# Altium schematic sheet Top_Sheet.SchDoc: Top Sheet
size A4; ApprovedBy: Watzek; CheckedBy: Watzek; Author: Watzek; DrawnBy: Watzek; Organization: HTL Hollabrunn; Address1: Abteilung Elektronik; Address2: Anton Ehrenfried-Straße 10; Address3: 2020 Hollabrunn; DocumentNumber: 01; Revision: 02; SheetNumber: 01; SheetTotal: 12; SPICEModelCacheIHPBHSPQ: <root> / <DocumentId>IHPBHSPQ</DocumentId> / <CacheFrame Number="0"> / <Model Name="cap" Kind="MDL"> / <Text>*Default semiconductor capacitor / .MODEL CAP C()</Text> / </Model> / </CacheFrame> / </root>
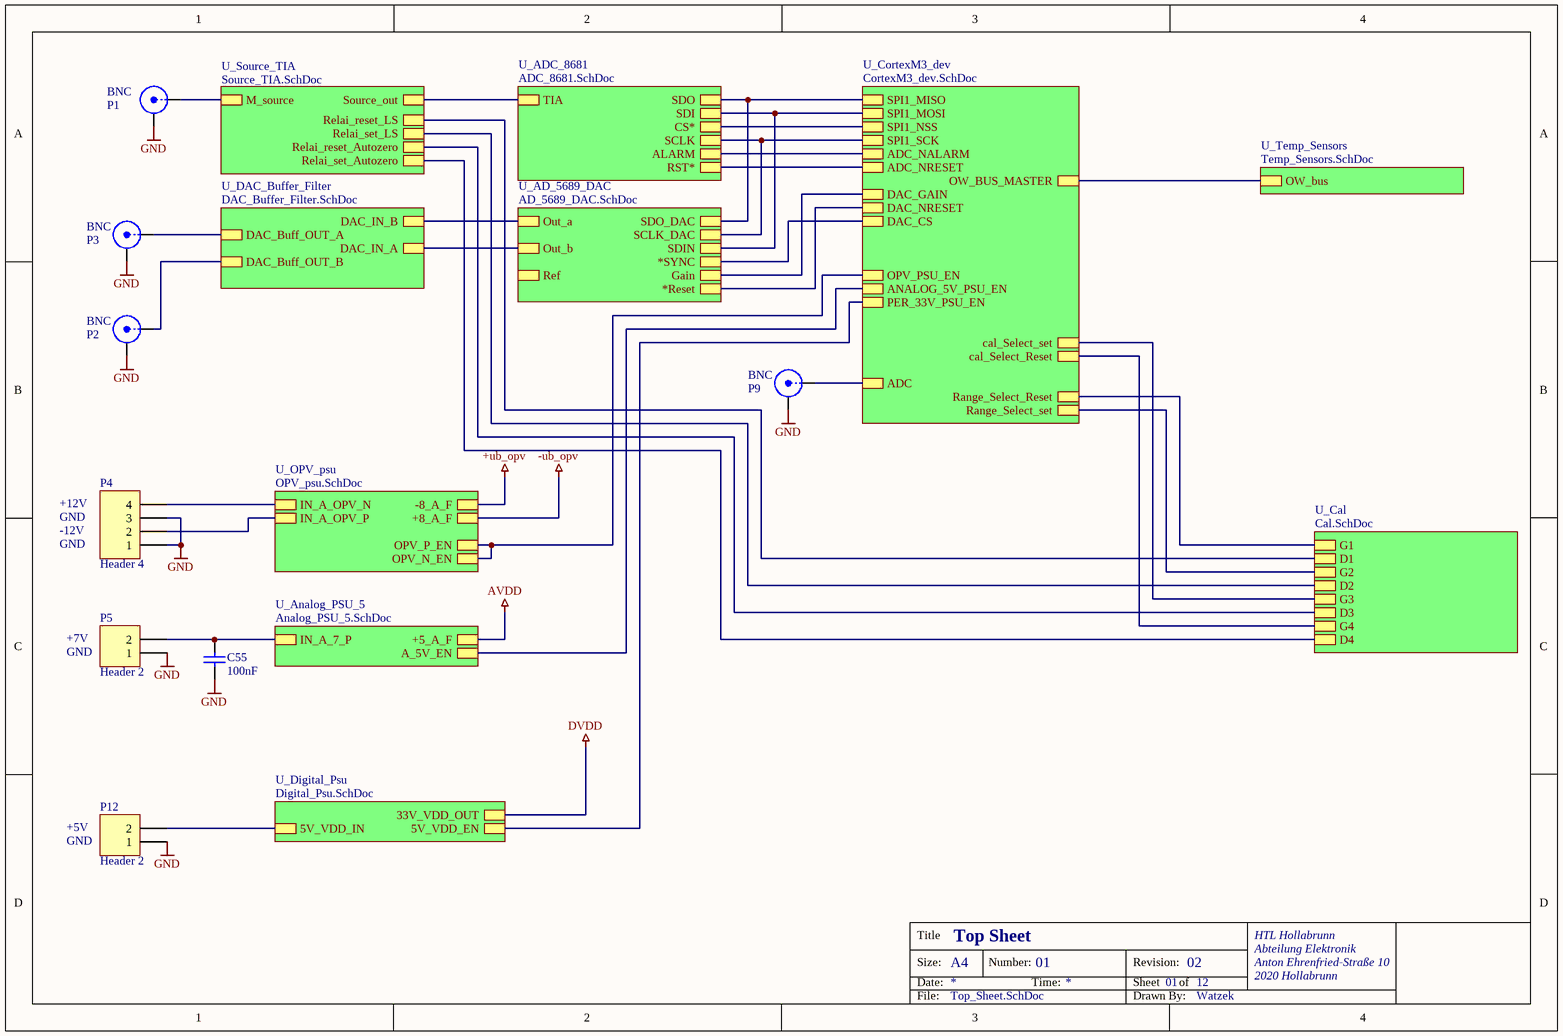
[diagram p0: Top_Sheet.SchDoc]

## Parts
C55  100nF  [C1206-KUE]
P1  BNC  [BNC_RA CON]
P2  BNC  [BNC_RA CON]
P3  BNC  [BNC_RA CON]
P4  Header 4  [HDR1X4]
P5  Header 2  [HDR1X2]
P9  BNC  [BNC_RA CON]
P12  Header 2  [HDR1X2]

## Sub-sheets
U_AD_5689_DAC = AD_5689_DAC.SchDoc: Ref, Out_a, Out_b, SDIN, SDO_DAC, SCLK_DAC, *SYNC, Gain, *Reset
U_ADC_8681 = ADC_8681.SchDoc: SDI, CS*, SCLK, SDO, ALARM, RST*, TIA
U_Analog_PSU_5 = Analog_PSU_5.SchDoc: IN_A_7_P, +5_A_F, A_5V_EN
U_Cal = Cal.SchDoc: G1, G2, D1, D2, G3, D3, G4, D4
U_CortexM3_dev = CortexM3_dev.SchDoc: SPI1_NSS, SPI1_SCK, SPI1_MISO, SPI1_MOSI, ADC_NALARM, ADC_NRESET, DAC_GAIN, DAC_NRESET, DAC_CS, OW_BUS_MASTER, OPV_PSU_EN, ANALOG_5V_PSU_EN, PER_33V_PSU_EN, Range_Select_set, Range_Select_Reset, ADC, cal_Select_Reset, cal_Select_set
U_DAC_Buffer_Filter = DAC_Buffer_Filter.SchDoc: DAC_IN_B, DAC_Buff_OUT_B, DAC_IN_A, DAC_Buff_OUT_A
U_Digital_Psu = Digital_Psu.SchDoc: 5V_VDD_IN, 33V_VDD_OUT, 5V_VDD_EN
U_OPV_psu = OPV_psu.SchDoc: IN_A_OPV_P, +8_A_F, IN_A_OPV_N, -8_A_F, OPV_P_EN, OPV_N_EN
U_Source_TIA = Source_TIA.SchDoc: M_source, Source_out, Relai_set_LS, Relai_reset_LS, Relai_reset_Autozero, Relai_set_Autozero
U_Temp_Sensors = Temp_Sensors.SchDoc: OW_bus

## Nets
+ub_opv: sheet U_OPV_psu/-8_A_F
-ub_opv: sheet U_OPV_psu/+8_A_F
AVDD: sheet U_Analog_PSU_5/+5_A_F
DVDD: sheet U_Digital_Psu/33V_VDD_OUT
GND: C55.1 P1.2(Y) P2.2(Y) P3.2(Y) P4.1 P4.3 P5.1 P9.2(Y) P12.1
NetC55_2: C55.2 P5.2 ; sheet U_Analog_PSU_5/IN_A_7_P
NetP1_1: P1.1(X) ; sheet U_Source_TIA/M_source
NetP2_1: P2.1(X) ; sheet U_DAC_Buffer_Filter/DAC_Buff_OUT_B
NetP3_1: P3.1(X) ; sheet U_DAC_Buffer_Filter/DAC_Buff_OUT_A
NetP4_2: P4.2 ; sheet U_OPV_psu/IN_A_OPV_P
NetP4_4: P4.4 ; sheet U_OPV_psu/IN_A_OPV_N
NetP9_1: P9.1(X) ; sheet U_CortexM3_dev/ADC
NetP12_2: P12.2 ; sheet U_Digital_Psu/5V_VDD_IN
(unnamed): sheet U_Source_TIA/Source_out, sheet U_ADC_8681/TIA
(unnamed): sheet U_Source_TIA/Relai_set_LS, sheet U_Cal/D2
(unnamed): sheet U_Source_TIA/Relai_reset_LS, sheet U_Cal/D1
(unnamed): sheet U_Source_TIA/Relai_reset_Autozero, sheet U_Cal/D3
(unnamed): sheet U_Source_TIA/Relai_set_Autozero, sheet U_Cal/D4
(unnamed): sheet U_DAC_Buffer_Filter/DAC_IN_B, sheet U_AD_5689_DAC/Out_a
(unnamed): sheet U_DAC_Buffer_Filter/DAC_IN_A, sheet U_AD_5689_DAC/Out_b
(unnamed): sheet U_ADC_8681/SDI, sheet U_AD_5689_DAC/SDIN, sheet U_CortexM3_dev/SPI1_MOSI
(unnamed): sheet U_ADC_8681/CS*, sheet U_CortexM3_dev/SPI1_NSS
(unnamed): sheet U_ADC_8681/SCLK, sheet U_AD_5689_DAC/SCLK_DAC, sheet U_CortexM3_dev/SPI1_SCK
(unnamed): sheet U_ADC_8681/SDO, sheet U_AD_5689_DAC/SDO_DAC, sheet U_CortexM3_dev/SPI1_MISO
(unnamed): sheet U_ADC_8681/ALARM, sheet U_CortexM3_dev/ADC_NALARM
(unnamed): sheet U_ADC_8681/RST*, sheet U_CortexM3_dev/ADC_NRESET
(unnamed): sheet U_AD_5689_DAC/*SYNC, sheet U_CortexM3_dev/DAC_CS
(unnamed): sheet U_AD_5689_DAC/Gain, sheet U_CortexM3_dev/DAC_GAIN
(unnamed): sheet U_AD_5689_DAC/*Reset, sheet U_CortexM3_dev/DAC_NRESET
(unnamed): sheet U_Temp_Sensors/OW_bus, sheet U_CortexM3_dev/OW_BUS_MASTER
(unnamed): sheet U_Digital_Psu/5V_VDD_EN, sheet U_CortexM3_dev/PER_33V_PSU_EN
(unnamed): sheet U_Analog_PSU_5/A_5V_EN, sheet U_CortexM3_dev/ANALOG_5V_PSU_EN
(unnamed): sheet U_OPV_psu/OPV_P_EN, sheet U_OPV_psu/OPV_N_EN, sheet U_CortexM3_dev/OPV_PSU_EN
(unnamed): sheet U_CortexM3_dev/Range_Select_set, sheet U_Cal/G2
(unnamed): sheet U_CortexM3_dev/Range_Select_Reset, sheet U_Cal/G1
(unnamed): sheet U_CortexM3_dev/cal_Select_Reset, sheet U_Cal/G4
(unnamed): sheet U_CortexM3_dev/cal_Select_set, sheet U_Cal/G3

## Notes on the sheet
- +12V
- GND
- -12V
- +7V
- +5V
- Title
- Size:
- Date:
- A4
- Number:
- Time:
- Revision:
- Sheet
- of
- HTL Hollabrunn
- Abteilung Elektronik
- Anton Ehrenfried-Straße 10
- 2020 Hollabrunn
- File:
- Drawn By:

## Library data of the parts
C55 = Capacitor: Manufacturer: Kemet; Bezeichnung: Kerko +-10% 63V; Published: 8-Jun-2000; LatestRevisionDate: 17-Jul-2002; LatestRevisionNote: Re-released for DXP Platform.; PackageReference: RAD-0.3; Publisher: Altium Limited; PackageDescription: Radial Cap, Thru-Hole; 2 Leads; 0.3 in Pin Spacing; Value: 100nF; Orderingcode: *
P1-P3 P9 = BNC: BNC Elbow Connector; LatestRevisionDate: 17-Jul-2002; LatestRevisionNote: Re-released for DXP Platform.; Publisher: Altium Limited
P4 = Header 4: Header, 4-Pin; LatestRevisionDate: 17-Jul-2002; LatestRevisionNote: Re-released for DXP Platform.; Publisher: Altium Limited
P5 P12 = Header 2: Header, 2-Pin; LatestRevisionDate: 17-Jul-2002; LatestRevisionNote: Re-released for DXP Platform.; Publisher: Altium Limited